# Altium project waffling60-BK.PrjPcb
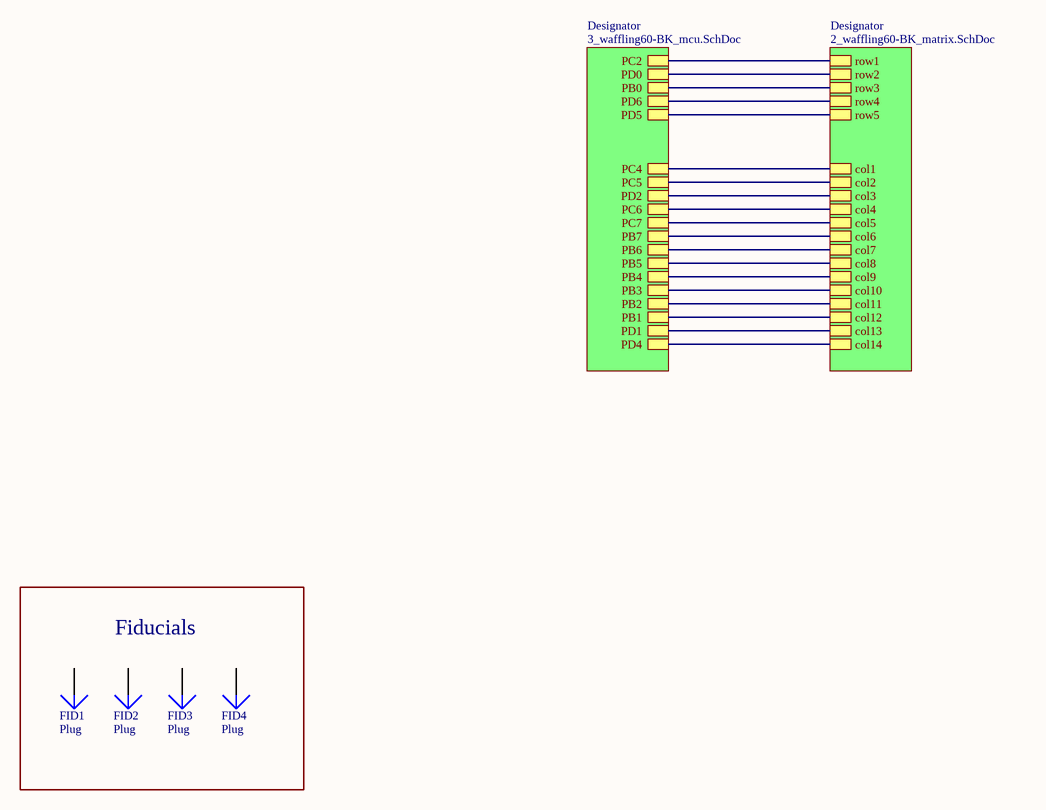
[diagram p0: 1_waffling60-BK_top.SchDoc]
ProjectTitle: Waffling60 - BK Solder; Revision: C1
3 sheets, 166 parts. Net scope: hierarchical (ports join the sheet entries above them; power ports are global).
Board file: waffling60-BK.PcbDoc
Sheets:
  1_waffling60-BK_top.SchDoc
    Designator = 3_waffling60-BK_mcu.SchDoc
    Designator = 2_waffling60-BK_matrix.SchDoc

## Sheet 1_waffling60-BK_top.SchDoc: =ProjectTitle
size A4; Engineer: 4pplet; Address1: github.com/4pplet/waffling60; Address2: Licence: CERN-OHL-S; Revision: C1; SheetNumber: 1; SheetTotal: 3; ProjectName: waffling60

### Parts
FID1  Plug  [Fiducial_Nordic]  (no BOM)
FID2  Plug  [Fiducial_Nordic]  (no BOM)
FID3  Plug  [Fiducial_Nordic]  (no BOM)
FID4  Plug  [Fiducial_Nordic]  (no BOM)

### Blocks framed on the sheet
Fiducials: FID1-FID4

### Sub-sheets
Designator = 3_waffling60-BK_mcu.SchDoc: PD0, PD1, PC2, PD2, PD4, PC4, PD5, PB5, PB6, PB4, PB2, PD6, PB3, PB1, PB0, PC7, PB7, PC6, PC5
Designator = 2_waffling60-BK_matrix.SchDoc: col6, col8, col5, col7, col3, col2, col1, col4, col9, row3, row1, row4, row2, row5, col11, col10, col14, col13, col12

### Nets
col1: sheet Designator/PC4, sheet Designator/col1
col2: sheet Designator/PC5, sheet Designator/col2
col3: sheet Designator/PD2, sheet Designator/col3
col4: sheet Designator/PC6, sheet Designator/col4
col5: sheet Designator/PC7, sheet Designator/col5
col6: sheet Designator/PB7, sheet Designator/col6
col7: sheet Designator/PB6, sheet Designator/col7
col8: sheet Designator/PB5, sheet Designator/col8
col9: sheet Designator/PB4, sheet Designator/col9
col10: sheet Designator/PB3, sheet Designator/col10
col11: sheet Designator/PB2, sheet Designator/col11
col12: sheet Designator/PB1, sheet Designator/col12
col13: sheet Designator/PD1, sheet Designator/col13
col14: sheet Designator/PD4, sheet Designator/col14
row1: sheet Designator/PC2, sheet Designator/row1
row2: sheet Designator/PD0, sheet Designator/row2
row3: sheet Designator/PB0, sheet Designator/row3
row4: sheet Designator/PD6, sheet Designator/row4
row5: sheet Designator/PD5, sheet Designator/row5

Not connected (* = marked no-connect by the designer): FID1 1; FID2 1; FID3 1; FID4 1

### Notes on the sheet
- Title
- Size:
- Date:
- A4
- Number:
- Time:
- Revision:
- Sheet
- of
- File:

## Sheet 3_waffling60-BK_mcu.SchDoc: =ProjectTitle
size A4; Address1: github.com/4pplet/waffling60; Address2: Licence: CERN-OHL-S; Revision: C1; SheetNumber: 3; SheetTotal: 3
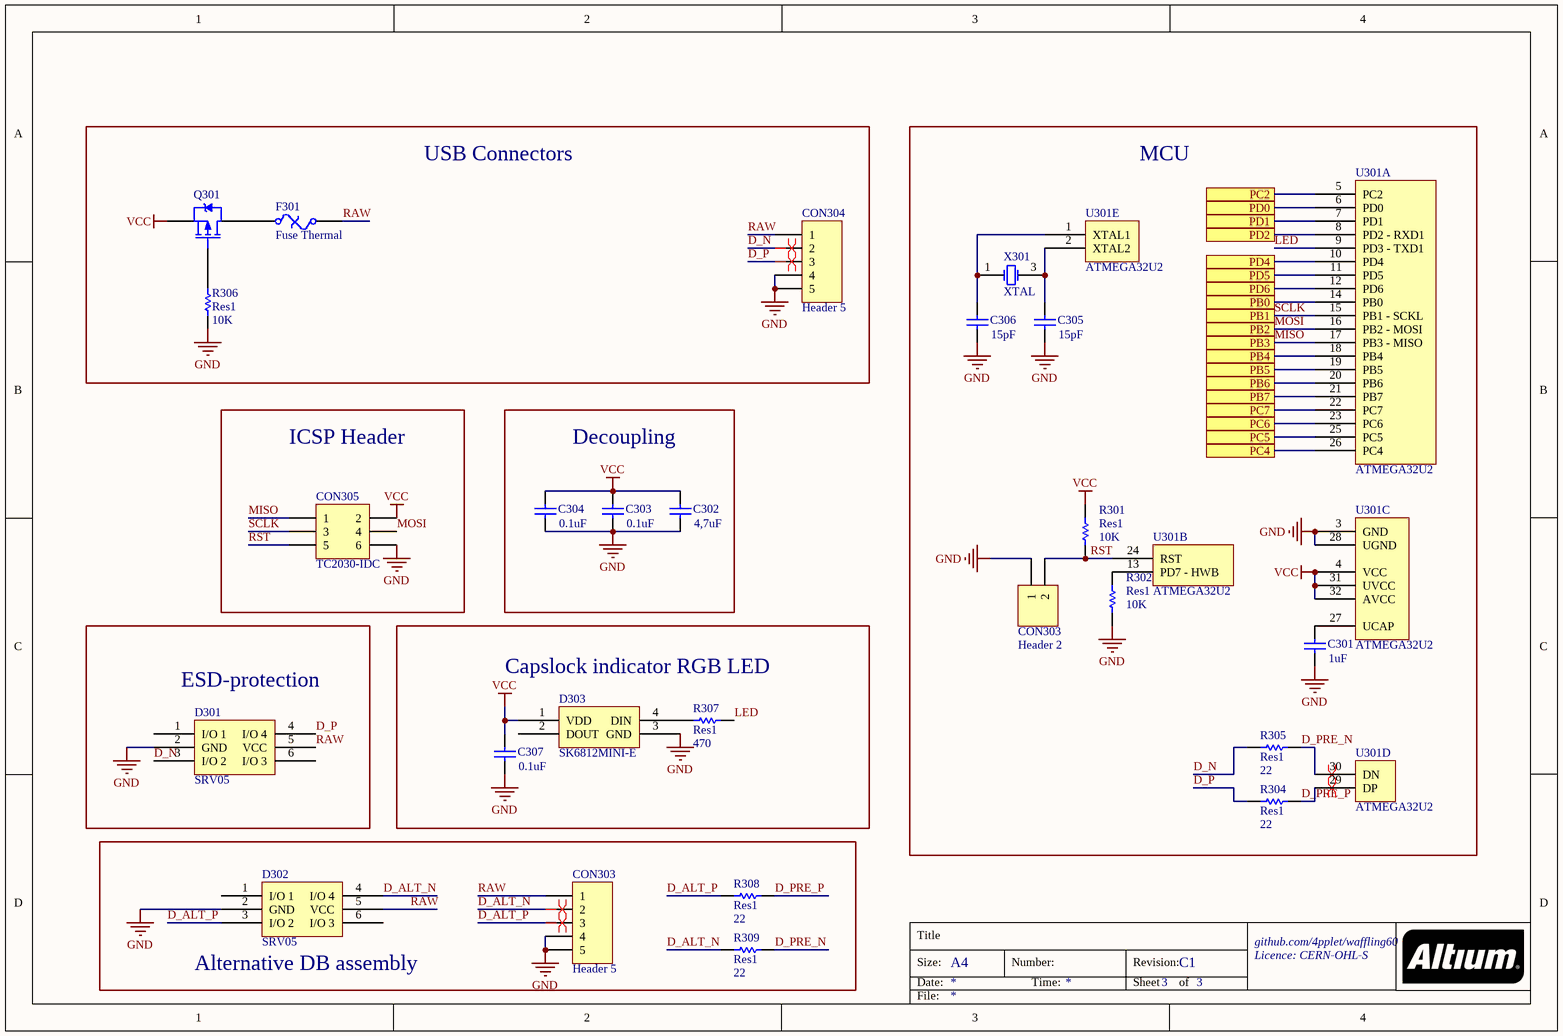
[diagram p1: 3_waffling60-BK_mcu.SchDoc]

### Parts
(Parts that share a designator on the sheet are numbered #1, #2 ... from top to bottom, then left to right.)
C301  value 1uF  [C0603[1608]]
C302  value 4,7uF  [C0603[1608]]
C303  value 0.1uF  [C0603[1608]]
C304  value 0.1uF  [C0603[1608]]
C305  value 15pF  [C0603[1608]]
C306  value 15pF  [C0603[1608]]
C307  value 0.1uF  [C0603[1608]]
CON303#1  Header 2  [HDR1X2]  (no BOM)
CON303#2  Header 5  [JST SM04B-SRSS-TB]
CON304  Header 5  [JST SM04B-SRSS-TB]
CON305  TC2030-IDC  [TC2030-IDC-NL]  (no BOM)
D301  SRV05  [SOT-23-6]
D302  SRV05  [SOT-23-6]  (no BOM)
D303  SK6812MINI-E  [SK6812MINI-E]
F301  Fuse Thermal  [C1206[3216]]
Q301  PMOS-2  [SOT-23-3]  (value not drawn)
R301  Res1  value 10K  [R0603[1608]]
R302  Res1  value 10K  [R0603[1608]]
R304  Res1  value 22  [R0603[1608]]
R305  Res1  value 22  [R0603[1608]]
R306  Res1  value 10K  [R0603[1608]]
R307  Res1  value 470  [R0603[1608]]
R308  Res1  value 22  [R0603[1608]]  (no BOM)
R309  Res1  value 22  [R0603[1608]]  (no BOM)
U301  ATMEGA32U2  [ATMEGA32U2-COMBO]  (parts A,B,C,D,E of 5)
X301  XTAL  [XTAL-3225]

### Blocks framed on the sheet
USB Connectors: CON304 F301 Q301 R306
MCU: C301 C305 C306 CON303#1 R301 R302 R304 R305 U301 X301
ICSP Header: CON305
Decoupling: C302-C304
ESD-protection: D301
Capslock indicator RGB LED: C307 D303 R307
Alternative DB assembly: CON303#2 D302 R308 R309

### Ports
PB0, PB1, PB2, PB3, PB4, PB5, PB6, PB7, PC2, PC4, PC5, PC6, PC7, PD0, PD1, PD2, PD4, PD5, PD6

### Nets
GND: C301.1 C302.1 C303.1 C304.1 C305.1 C306.1 C307.1 CON303#1.1 CON303#2.4 CON303#2.5 CON304.4 CON304.5 CON305.6 D301.2(GND) D302.2(GND) D303.3(GND) R302.2 R306.2 U301.3(GND) U301.28(UGND) X301.2(GND) X301.4(GND)
VCC: C302.2 C303.2 C304.2 C307.2 CON305.2 D303.1(VDD) Q301.2(S) R301.1 U301.4(VCC) U301.31(UVCC) U301.32(AVCC)
col1: U301.26(PC4) ; port PC4
col2: U301.25(PC5) ; port PC5
col3: U301.8(PD2_-_RXD1) ; port PD2
col4: U301.23(PC6) ; port PC6
col5: U301.22(PC7) ; port PC7
col6: U301.21(PB7) ; port PB7
col7: U301.20(PB6) ; port PB6
col8: U301.19(PB5) ; port PB5
col9: U301.18(PB4) ; port PB4
col13: U301.7(PD1) ; port PD1
col14: U301.10(PD4) ; port PD4
D_ALT_N: CON303#2.2 D302.4(I/O_4) R309.2
D_ALT_P: CON303#2.3 D302.3(I/O_2) R308.2
D_N: CON304.2 D301.3(I/O_2) R305.2
D_P: CON304.3 D301.4(I/O_4) R304.2
D_PRE_N: R305.1 R309.1 U301.30(DN)
D_PRE_P: R304.1 R308.1 U301.29(DP)
LED: R307.2 U301.9(PD3_-_TXD1)
MISO: CON305.1 U301.17(PB3_-_MISO) ; port PB3  [project net col10]
MOSI: CON305.4 U301.16(PB2_-_MOSI) ; port PB2  [project net col11]
RAW: CON303#2.1 CON304.1 D301.5(VCC) D302.5(VCC) F301.2
row1: U301.5(PC2) ; port PC2
row2: U301.6(PD0) ; port PD0
row3: U301.14(PB0) ; port PB0
row4: U301.12(PD6) ; port PD6
row5: U301.11(PD5) ; port PD5
RST: CON303#1.2 CON305.5 R301.2 U301.24(RST)
SCLK: CON305.3 U301.15(PB1_-_SCKL) ; port PB1  [project net col12]
NetC301_2: C301.2 U301.27(UCAP)
NetC305_2: C305.2 U301.2(XTAL2) X301.3(OSC2)
NetC306_2: C306.2 U301.1(XTAL1) X301.1(OSC1)
NetD303_4: D303.4(DIN) R307.1
NetF301_1: F301.1 Q301.3(D)
NetQ301_1: Q301.1(G) R306.1
NetR302_1: R302.1 U301.13(PD7_-_HWB)

Not connected (* = marked no-connect by the designer): D301 1(I/O_1) 6(I/O_3); D302 1(I/O_1) 6(I/O_3); D303 2(DOUT)

### Layout directives
differential pair: D_ALT_N, D_ALT_P, D_N, D_P, D_PRE_N, D_PRE_P

### Notes on the sheet
- Title
- Size:
- Date:
- A4
- Number:
- Time:
- Revision:
- Sheet
- of
- File:

### Library data of the parts
C301 = Cap: Capacitor; MRF.Part: CL10A105KB8NNNC; MFG: KEMET; MFGPN: C0603C104M5RACTU; LCSC MFG: Samsung Electro-Mechanics; Version: 0603 imperial; LCSC Part #: C15849
C302 = Cap: Capacitor; MRF.Part: CL10A475KO8NNNC; LCSC MFG: Samsung Electro-Mechanics; LCSC Part #: C19666
C303 C304 C307 = Cap: Capacitor; MRF.Part: CC0603KRX7R9BB104; MFG: KEMET; MFGPN: C0603C104M5RACTU; LCSC MFG: YAGEO; Version: 0603 imperial; LCSC Part #: C14663
C305 C306 = Cap: Capacitor; MRF.Part: CL10C150JB8NNNC; LCSC MFG: Samsung Electro-Mechanics; Version: 0603 imperial; LCSC Part #: C1644
CON303#1 = Header 2: Header, 2-Pin
CON303#2 = Header 5: Header, 5-Pin; MFGPN: SM04B-SRSS-TB(LF)(SN); MFG: JST Sales America Inc.; LCSC MFG: JST Sales America; LCSC Part #: C160404; MRF.Part: SM04B-SRSS-TB(LF)(SN)
CON304 = Header 5: JST for USB daughter board; MFGPN: SM04B-SRSS-TB(LF)(SN); MFG: JST Sales America Inc.; LCSC MFG: JST Sales America; LCSC Part #: C160404; MRF.Part: SM04B-SRSS-TB(LF)(SN)
CON305 = Header 3X2: TagConnect header
D301 D302 = SRV05: MRF.Part: SRV05-4-P-T7; LCSC MFG: ProTek Devices; LCSC Part #: C85364
D303 = SK6812MINI-E: MRF.Part: DY-S352818/RGBC/6812-2T; LCSC MFG: TONYU; LCSC Part #: C524051
F301 = Fuse Thermal: Thermal Fuse; MRF.Part: ASMD1206-050; MFG: Bel Fuse Inc.; MFGPN: 0ZCJ0050FF2G; LCSC MFG: Shenzhen JDT Fuse; LCSC Part #: C135338
Q301 = PMOS-2: P-Channel Power MOSFET; MRF.Part: SI2301CDS-T1-GE3; LCSC MFG: Vishay Intertech; LCSC Part #: C10487; Version: SOT23-3
R301 R302 R306 = Res1: Resistor; MRF.Part: 0603WAF1002T5E; MFG: Panasonic Electronic Components; MFGPN: ERJ-3EKF5101V; LCSC MFG: Uniroyal Elec; Version: 0603 imperial; LCSC Part #: C25804
R304 R305 R308 R309 = Res1: Resistor; MRF.Part: 0603WAF220JT5E; MFG: Panasonic Electronic Components; MFGPN: ERJ-3EKF5101V; LCSC MFG: Uniroyal Elec; Version: 0603 imperial; LCSC Part #: C23345
R307 = Res1: Resistor; MRF.Part: 0603WAF4700T5E; MFG: Panasonic Electronic Components; MFGPN: ERJ-3EKF5101V; LCSC MFG: UNI-ROYAL(Uniroyal Elec); Version: 0603 imperial; LCSC Part #: C23179
U301 = ATMEGA32U2: MRF.Part: ATMEGA32U2-MU; MFG: Microchip Technology; MFGPN: ATMEGA32U2-AUR; LCSC MFG: Microchip Tech; LCSC Part #: C57345
X301 = XTAL: Crystal Oscillator; MRF.Part: X322516MLB4SI; LCSC MFG: Yangxing Tech; LCSC Part #: C13738

## Sheet 2_waffling60-BK_matrix.SchDoc: =ProjectTitle
size A3; Address1: github.com/4pplet/waffling60; Address2: Licence: CERN-OHL-S; Revision: C1; SheetNumber: 2; SheetTotal: 3
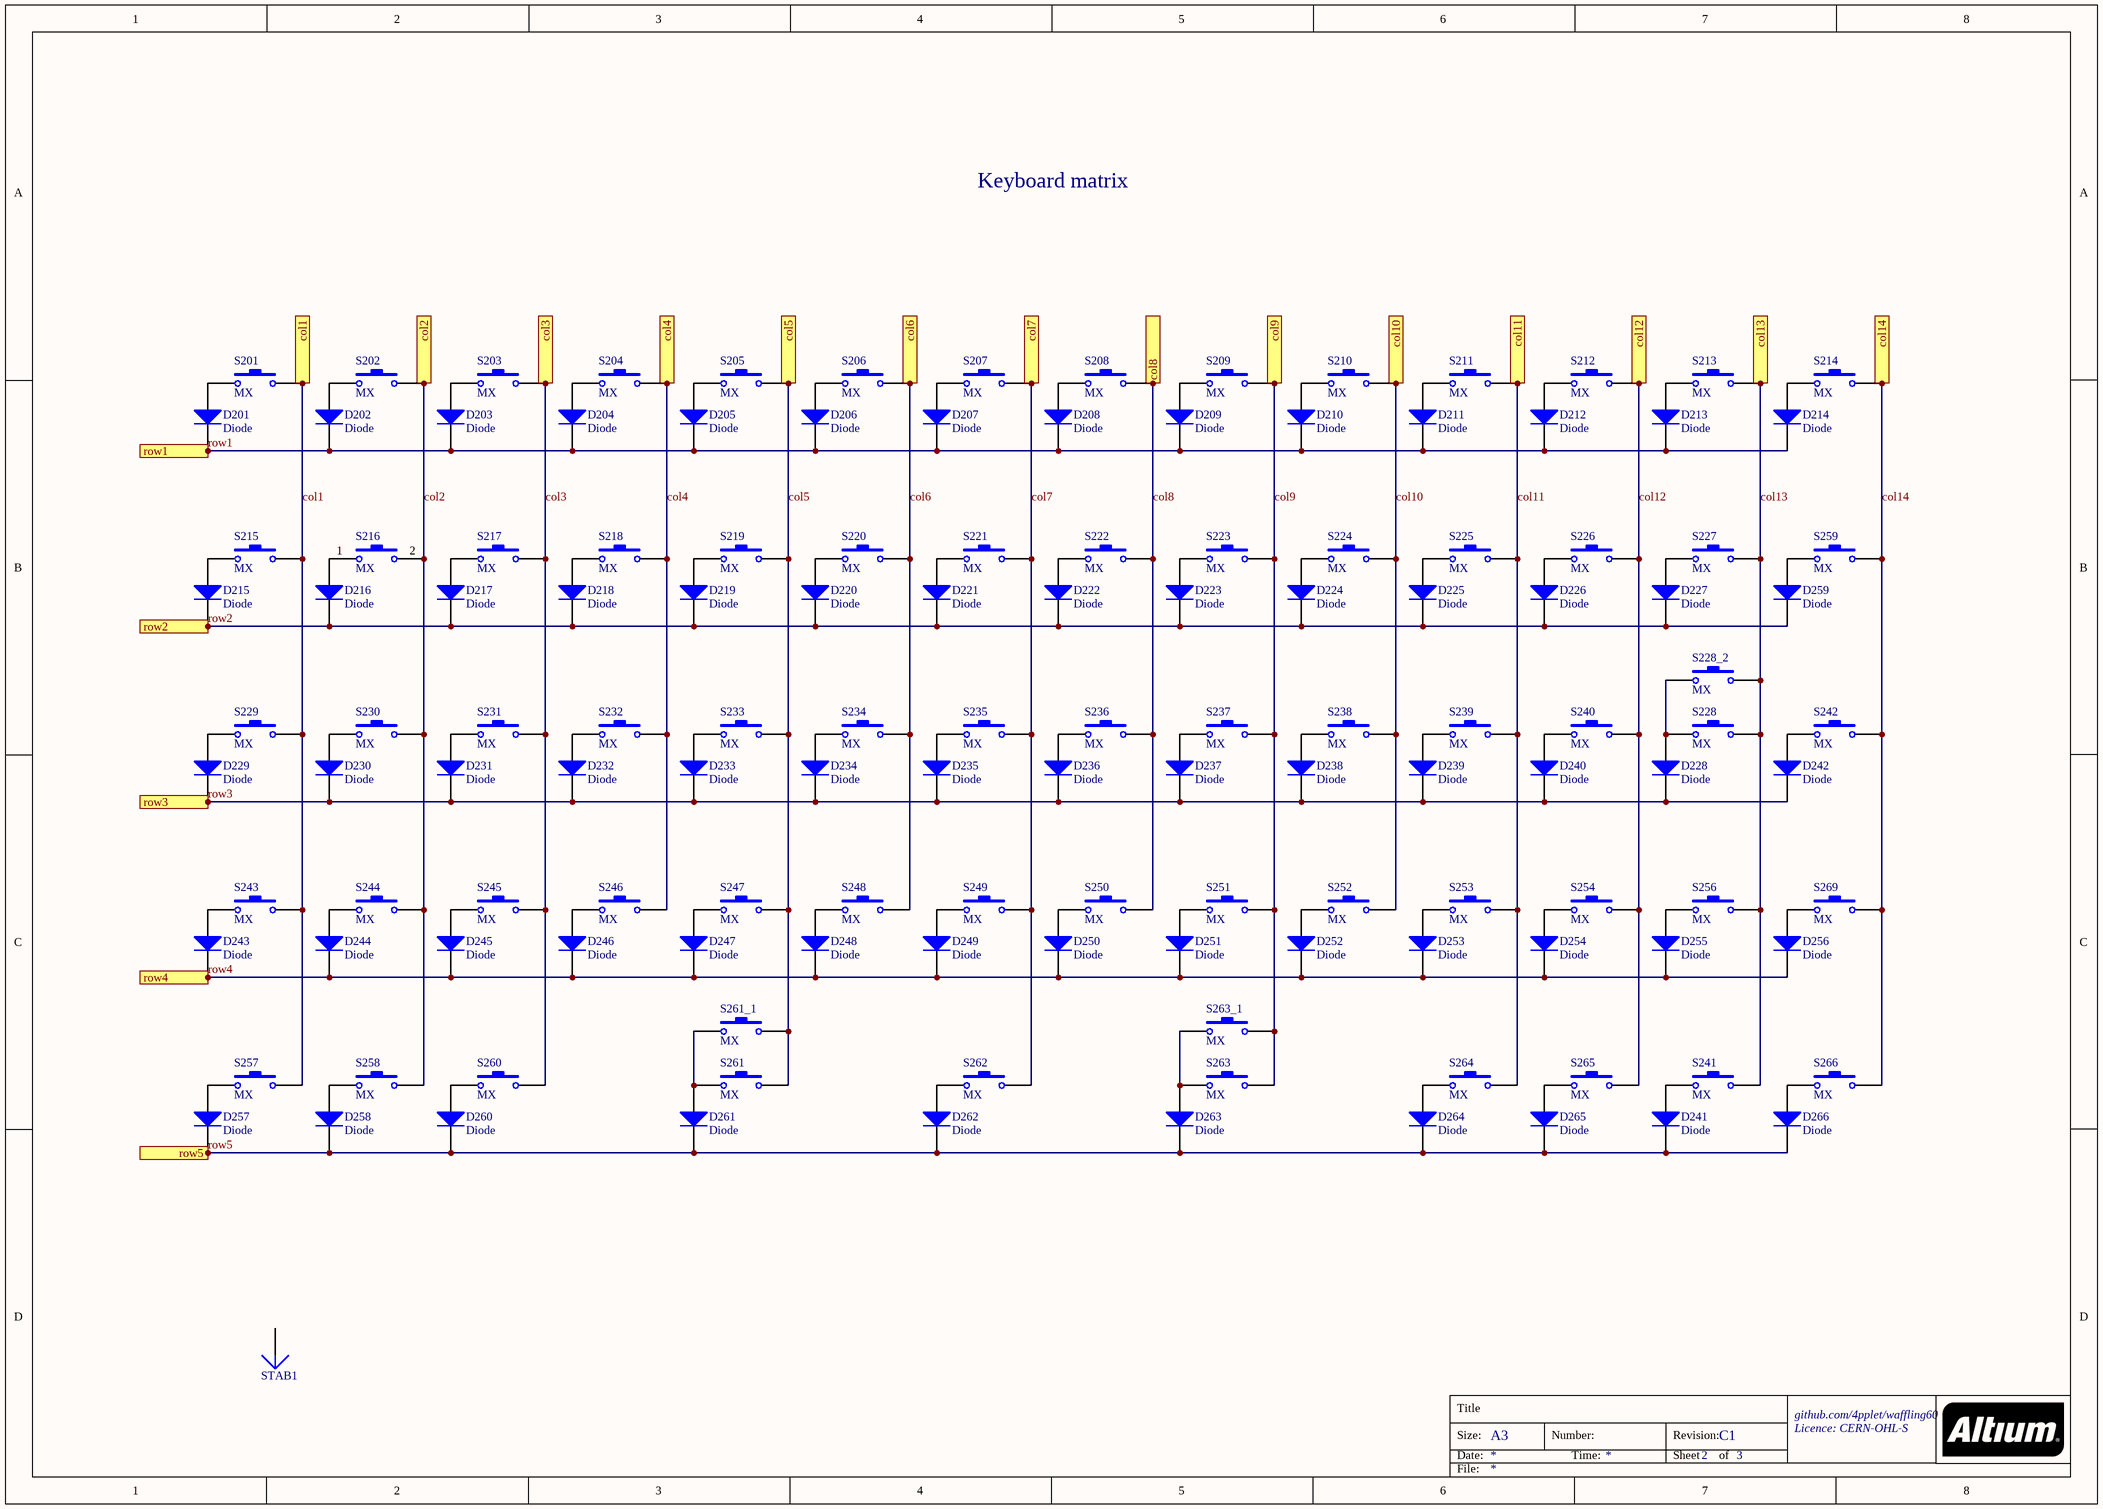
[diagram p2: 2_waffling60-BK_matrix.SchDoc]

### Parts
D201  Diode  [SOD-123]
D202  Diode  [SOD-123]
D203  Diode  [SOD-123]
D204  Diode  [SOD-123]
D205  Diode  [SOD-123]
D206  Diode  [SOD-123]
D207  Diode  [SOD-123]
D208  Diode  [SOD-123]
D209  Diode  [SOD-123]
D210  Diode  [SOD-123]
D211  Diode  [SOD-123]
D212  Diode  [SOD-123]
D213  Diode  [SOD-123]
D214  Diode  [SOD-123]
D215  Diode  [SOD-123]
D216  Diode  [SOD-123]
D217  Diode  [SOD-123]
D218  Diode  [SOD-123]
D219  Diode  [SOD-123]
D220  Diode  [SOD-123]
D221  Diode  [SOD-123]
D222  Diode  [SOD-123]
D223  Diode  [SOD-123]
D224  Diode  [SOD-123]
D225  Diode  [SOD-123]
D226  Diode  [SOD-123]
D227  Diode  [SOD-123]
D228  Diode  [SOD-123]
D229  Diode  [SOD-123]
D230  Diode  [SOD-123]
D231  Diode  [SOD-123]
D232  Diode  [SOD-123]
D233  Diode  [SOD-123]
D234  Diode  [SOD-123]
D235  Diode  [SOD-123]
D236  Diode  [SOD-123]
D237  Diode  [SOD-123]
D238  Diode  [SOD-123]
D239  Diode  [SOD-123]
D240  Diode  [SOD-123]
D241  Diode  [SOD-123]
D242  Diode  [SOD-123]
D243  Diode  [SOD-123]
D244  Diode  [SOD-123]
D245  Diode  [SOD-123]
D246  Diode  [SOD-123]
D247  Diode  [SOD-123]
D248  Diode  [SOD-123]
D249  Diode  [SOD-123]
D250  Diode  [SOD-123]
D251  Diode  [SOD-123]
D252  Diode  [SOD-123]
D253  Diode  [SOD-123]
D254  Diode  [SOD-123]
D255  Diode  [SOD-123]
D256  Diode  [SOD-123]
D257  Diode  [SOD-123]
D258  Diode  [SOD-123]
D259  Diode  [SOD-123]
D260  Diode  [SOD-123]
D261  Diode  [SOD-123]
D262  Diode  [SOD-123]
D263  Diode  [SOD-123]
D264  Diode  [SOD-123]
D265  Diode  [SOD-123]
D266  Diode  [SOD-123]
S201  MX  [MX-switch - switched pol]  (no BOM)
S202  MX  [MX-switch]  (no BOM)
S203  MX  [MX-switch - switched pol]  (no BOM)
S204  MX  [MX-switch - switched pol]  (no BOM)
S205  MX  [MX-switch - switched pol]  (no BOM)
S206  MX  [MX-switch - switched pol]  (no BOM)
S207  MX  [MX-switch - switched pol]  (no BOM)
S208  MX  [MX-switch - switched pol]  (no BOM)
S209  MX  [MX-switch - switched pol]  (no BOM)
S210  MX  [MX-switch - switched pol]  (no BOM)
S211  MX  [MX-switch - switched pol]  (no BOM)
S212  MX  [MX-switch - switched pol]  (no BOM)
S213  MX  [MX-switch - switched pol]  (no BOM)
S214  MX  [MX-switch]  (no BOM)
S215  MX  [MX-switch - switched pol]  (no BOM)
S216  MX  [MX-switch]  (no BOM)
S217  MX  [MX-switch - switched pol]  (no BOM)
S218  MX  [MX-switch - switched pol]  (no BOM)
S219  MX  [MX-switch - switched pol]  (no BOM)
S220  MX  [MX-switch]  (no BOM)
S221  MX  [MX-switch - switched pol]  (no BOM)
S222  MX  [MX-switch]  (no BOM)
S223  MX  [MX-switch - switched pol]  (no BOM)
S224  MX  [MX-switch - switched pol]  (no BOM)
S225  MX  [MX-switch - switched pol]  (no BOM)
S226  MX  [MX-switch]  (no BOM)
S227  MX  [MX-switch]  (no BOM)
S228  MX  [MX-switch - 1.5U - switched pol]  (no BOM)
S228_2  MX  [MX-switch - switched pol]  (no BOM)
S229  MX  [MX-switch - CAPS]  (no BOM)
S230  MX  [MX-switch]  (no BOM)
S231  MX  [MX-switch - switched pol]  (no BOM)
S232  MX  [MX-switch - switched pol]  (no BOM)
S233  MX  [MX-switch - switched pol]  (no BOM)
S234  MX  [MX-switch - switched pol]  (no BOM)
S235  MX  [MX-switch - switched pol]  (no BOM)
S236  MX  [MX-switch - switched pol]  (no BOM)
S237  MX  [MX-switch - switched pol]  (no BOM)
S238  MX  [MX-switch - switched pol]  (no BOM)
S239  MX  [MX-switch - switched pol]  (no BOM)
S240  MX  [MX-switch - switched pol]  (no BOM)
S241  MX  [MX-switch - 1u MOD-R]  (no BOM)
S242  MX  [MX-switch - Enter - Rotated Stab]  (no BOM)
S243  MX  [MX-switch - Left shift]  (no BOM)
S244  MX  [MX-switch]  (no BOM)
S245  MX  [MX-switch - switched pol]  (no BOM)
S246  MX  [MX-switch - switched pol]  (no BOM)
S247  MX  [MX-switch - switched pol]  (no BOM)
S248  MX  [MX-switch - switched pol]  (no BOM)
S249  MX  [MX-switch - switched pol]  (no BOM)
S250  MX  [MX-switch - switched pol]  (no BOM)
S251  MX  [MX-switch - switched pol]  (no BOM)
S252  MX  [MX-switch - switched pol]  (no BOM)
S253  MX  [MX-switch - switched pol]  (no BOM)
S254  MX  [MX-switch - switched pol]  (no BOM)
S256  MX  [MX-switch - right shift]  (no BOM)
S257  MX  [MX-switch - 1.5u MOD-L]  (no BOM)
S258  MX  [MX-switch - 1u MOD-L]  (no BOM)
S259  MX  [MX-switch - backspace]  (no BOM)
S260  MX  [MX-switch - 1.5u MOD-L]  (no BOM)
S261  MX  [MX-SWITCH - L SPLIT SPACE_V2]  (no BOM)
S261_1  MX  [MX-switch - 3U - rotated stab]  (no BOM)
S262  MX  [MX-switch - Space_V3]  (no BOM)
S263  MX  [MX-SWITCH - R SPLIT SPACE_V2]  (no BOM)
S263_1  MX  [MX-switch - 3U - rotated stab]  (no BOM)
S264  MX  [MX-switch - switched pol]  (no BOM)
S265  MX  [MX-switch - 1.5u MOD-R]  (no BOM)
S266  MX  [MX-switch - 1.5u MOD-R]  (no BOM)
S269  MX  [MX-switch]  (no BOM)
STAB1  Plug  [Stab 10U]  (value not drawn)  (no BOM)

### Ports
col1, col2, col3, col4, col5, col6, col7, col8, col9, col10, col11, col12, col13, col14, row1, row2, row3, row4, row5

### Nets
col1: S201.2 S215.2 S229.1 S243.2 S257.1 ; port col1
col2: S202.2 S216.2 S230.2 S244.1 S258.2 ; port col2
col3: S203.2 S217.2 S231.2 S245.2 S260.2 ; port col3
col4: S204.2 S218.2 S232.2 S246.2 ; port col4
col5: S205.2 S219.2 S233.2 S247.2 S261.2 S261_1.2 ; port col5
col6: S206.2 S220.2 S234.2 S248.2 ; port col6
col7: S207.2 S221.2 S235.2 S249.2 S262.1 ; port col7
col8: S208.2 S222.2 S236.2 S250.2 ; port col8
col9: S209.2 S223.2 S237.2 S251.2 S263.1 S263_1.1 ; port col9
col10: S210.2 S224.2 S238.2 S252.2 ; port col10
col11: S211.2 S225.2 S239.2 S253.2 S264.2 ; port col11
col12: S212.2 S226.2 S240.2 S254.2 S265.1 ; port col12
col13: S213.2 S227.2 S228.2 S228_2.2 S241.1 S256.2 ; port col13
col14: S214.2 S242.2 S259.2 S266.2 S269.2 ; port col14
row1: D201.2(K) D202.2(K) D203.2(K) D204.2(K) D205.2(K) D206.2(K) D207.2(K) D208.2(K) D209.2(K) D210.2(K) D211.2(K) D212.2(K) D213.2(K) D214.2(K) ; port row1
row2: D215.2(K) D216.2(K) D217.2(K) D218.2(K) D219.2(K) D220.2(K) D221.2(K) D222.2(K) D223.2(K) D224.2(K) D225.2(K) D226.2(K) D227.2(K) D259.2(K) ; port row2
row3: D228.2(K) D229.2(K) D230.2(K) D231.2(K) D232.2(K) D233.2(K) D234.2(K) D235.2(K) D236.2(K) D237.2(K) D238.2(K) D239.2(K) D240.2(K) D242.2(K) ; port row3
row4: D243.2(K) D244.2(K) D245.2(K) D246.2(K) D247.2(K) D248.2(K) D249.2(K) D250.2(K) D251.2(K) D252.2(K) D253.2(K) D254.2(K) D255.2(K) D256.2(K) ; port row4
row5: D241.2(K) D257.2(K) D258.2(K) D260.2(K) D261.2(K) D262.2(K) D263.2(K) D264.2(K) D265.2(K) D266.2(K) ; port row5
NetD201_1: D201.1(A) S201.1
NetD202_1: D202.1(A) S202.1
NetD203_1: D203.1(A) S203.1
NetD204_1: D204.1(A) S204.1
NetD205_1: D205.1(A) S205.1
NetD206_1: D206.1(A) S206.1
NetD207_1: D207.1(A) S207.1
NetD208_1: D208.1(A) S208.1
NetD209_1: D209.1(A) S209.1
NetD210_1: D210.1(A) S210.1
NetD211_1: D211.1(A) S211.1
NetD212_1: D212.1(A) S212.1
NetD213_1: D213.1(A) S213.1
NetD214_1: D214.1(A) S214.1
NetD215_1: D215.1(A) S215.1
NetD216_1: D216.1(A) S216.1
NetD217_1: D217.1(A) S217.1
NetD218_1: D218.1(A) S218.1
NetD219_1: D219.1(A) S219.1
NetD220_1: D220.1(A) S220.1
NetD221_1: D221.1(A) S221.1
NetD222_1: D222.1(A) S222.1
NetD223_1: D223.1(A) S223.1
NetD224_1: D224.1(A) S224.1
NetD225_1: D225.1(A) S225.1
NetD226_1: D226.1(A) S226.1
NetD227_1: D227.1(A) S227.1
NetD228_1: D228.1(A) S228.1 S228_2.1
NetD229_1: D229.1(A) S229.2
NetD230_1: D230.1(A) S230.1
NetD231_1: D231.1(A) S231.1
NetD232_1: D232.1(A) S232.1
NetD233_1: D233.1(A) S233.1
NetD234_1: D234.1(A) S234.1
NetD235_1: D235.1(A) S235.1
NetD236_1: D236.1(A) S236.1
NetD237_1: D237.1(A) S237.1
NetD238_1: D238.1(A) S238.1
NetD239_1: D239.1(A) S239.1
NetD240_1: D240.1(A) S240.1
NetD241_1: D241.1(A) S241.2
NetD242_1: D242.1(A) S242.1
NetD243_1: D243.1(A) S243.1
NetD244_1: D244.1(A) S244.2
NetD245_1: D245.1(A) S245.1
NetD246_1: D246.1(A) S246.1
NetD247_1: D247.1(A) S247.1
NetD248_1: D248.1(A) S248.1
NetD249_1: D249.1(A) S249.1
NetD250_1: D250.1(A) S250.1
NetD251_1: D251.1(A) S251.1
NetD252_1: D252.1(A) S252.1
NetD253_1: D253.1(A) S253.1
NetD254_1: D254.1(A) S254.1
NetD255_1: D255.1(A) S256.1
NetD256_1: D256.1(A) S269.1
NetD257_1: D257.1(A) S257.2
NetD258_1: D258.1(A) S258.1
NetD259_1: D259.1(A) S259.1
NetD260_1: D260.1(A) S260.1
NetD261_1: D261.1(A) S261.1 S261_1.1
NetD262_1: D262.1(A) S262.2
NetD263_1: D263.1(A) S263.2 S263_1.2
NetD264_1: D264.1(A) S264.1
NetD265_1: D265.1(A) S265.2
NetD266_1: D266.1(A) S266.1

Not connected (* = marked no-connect by the designer): STAB1 1

### Notes on the sheet
- Keyboard matrix
- Title
- Size:
- Date:
- A3
- Number:
- Time:
- Revision:
- Sheet
- of
- File:

### Library data of the parts
D201-D266 = Diode: Default Diode; MRF.Part: 1N4148W; LCSC MFG: ST(Semtech); Version: SOD-123; LCSC Part #: C81598
S201-S214 S216-S228 S228_2 S229-S254 S256-S261 S261_1 S262 S263 S263_1 S264-S266 S269 = SW-PB: Switch
S215 = SW-PB: TAB

## Nets that join several sheets
col1: 3_waffling60-BK_mcu (U301.26), 2_waffling60-BK_matrix (5 pins)
col2: 3_waffling60-BK_mcu (U301.25), 2_waffling60-BK_matrix (5 pins)
col3: 3_waffling60-BK_mcu (U301.8), 2_waffling60-BK_matrix (5 pins)
col4: 3_waffling60-BK_mcu (U301.23), 2_waffling60-BK_matrix (S204.2 S218.2 S232.2 S246.2)
col5: 3_waffling60-BK_mcu (U301.22), 2_waffling60-BK_matrix (6 pins)
col6: 3_waffling60-BK_mcu (U301.21), 2_waffling60-BK_matrix (S206.2 S220.2 S234.2 S248.2)
col7: 3_waffling60-BK_mcu (U301.20), 2_waffling60-BK_matrix (5 pins)
col8: 3_waffling60-BK_mcu (U301.19), 2_waffling60-BK_matrix (S208.2 S222.2 S236.2 S250.2)
col9: 3_waffling60-BK_mcu (U301.18), 2_waffling60-BK_matrix (6 pins)
col10: 3_waffling60-BK_mcu (CON305.1 U301.17), 2_waffling60-BK_matrix (S210.2 S224.2 S238.2 S252.2)
col11: 3_waffling60-BK_mcu (CON305.4 U301.16), 2_waffling60-BK_matrix (5 pins)
col12: 3_waffling60-BK_mcu (CON305.3 U301.15), 2_waffling60-BK_matrix (5 pins)
col13: 3_waffling60-BK_mcu (U301.7), 2_waffling60-BK_matrix (6 pins)
col14: 3_waffling60-BK_mcu (U301.10), 2_waffling60-BK_matrix (5 pins)
row1: 3_waffling60-BK_mcu (U301.5), 2_waffling60-BK_matrix (14 pins)
row2: 3_waffling60-BK_mcu (U301.6), 2_waffling60-BK_matrix (14 pins)
row3: 3_waffling60-BK_mcu (U301.14), 2_waffling60-BK_matrix (14 pins)
row4: 3_waffling60-BK_mcu (U301.12), 2_waffling60-BK_matrix (14 pins)
row5: 3_waffling60-BK_mcu (U301.11), 2_waffling60-BK_matrix (10 pins)